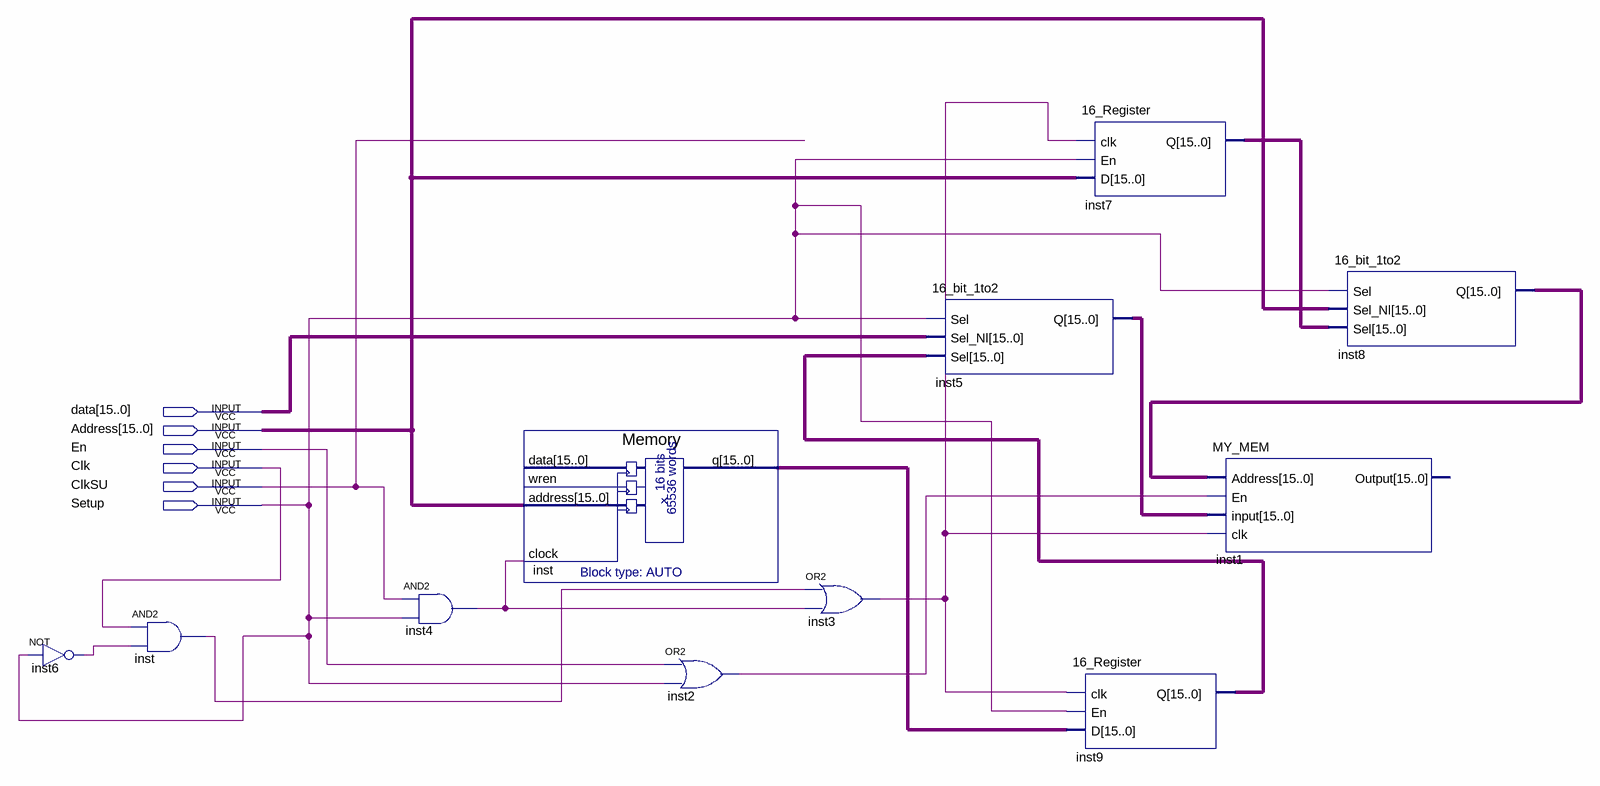
[diagram p0: schematic sheet]
// Quartus schematic MEM_INIT.bdf as structural Verilog: 11 symbols, 6 pins
module MEM_INIT (
  input  [15:0] data,
  input  [15:0] Address,
  input  En,
  input  Clk,
  input  ClkSU,
  input  Setup
);

  wire inst2_out, inst3_out, inst4_out, inst6_out, inst_out;
  wire [15:0] inst5_q, inst7_q, inst8_q, inst9_q, inst_q;

  not inst6 (inst6_out, Setup);
  and inst (inst_out, Clk, inst6_out);
  and inst4 (inst4_out, ClkSU, Setup);
  Memory inst_dup2 (.address(Address), .clock(inst4_out), .q(inst_q));  // open: data, wren
  or inst2 (inst2_out, En, Setup);
  or inst3 (inst3_out, inst_out, inst4_out);
  \16_bit_1to2  inst5 (.Sel({inst9_q[15:1], Setup, inst9_q[0]}), .Sel_Nl(data), .Q(inst5_q));
  \16_Register  inst7 (.clk(inst3_out), .En(Setup), .D(Address), .Q(inst7_q));
  \16_Register  inst9 (.clk(inst3_out), .En(Setup), .D(inst_q), .Q(inst9_q));
  MY_MEM inst1 (.Address(inst8_q), .En(inst2_out), .\input (inst5_q), .clk(inst3_out));  // open: Output
  \16_bit_1to2  inst8 (.Sel({inst7_q[15:1], Setup, inst7_q[0]}), .Sel_Nl(Address), .Q(inst8_q));
endmodule
